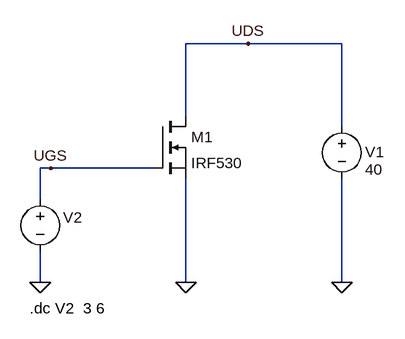
[diagram p0: schematic ID_vs_UGS.asc]
ID_vs_UGS.asc, the LTspice schematic file:
Version 4
SHEET 1 1292 680
WIRE -624 -240 -720 -240
WIRE -480 -240 -624 -240
WIRE -720 -128 -720 -240
WIRE -480 -112 -480 -240
WIRE -928 -48 -944 -48
WIRE -768 -48 -928 -48
WIRE -944 0 -944 -48
WIRE -944 128 -944 80
WIRE -720 128 -720 -32
WIRE -480 128 -480 -32
FLAG -480 128 0
FLAG -944 128 0
FLAG -720 128 0
FLAG -624 -240 UDS
FLAG -928 -48 UGS
SYMBOL voltage -480 -128 R0
WINDOW 123 0 0 Left 2
WINDOW 39 37 60 Left 2
WINDOW 0 36 55 Left 2
WINDOW 3 36 82 Left 2
SYMATTR InstName V1
SYMATTR Value 40
SYMBOL voltage -944 -16 R0
WINDOW 123 0 0 Left 2
WINDOW 39 40 53 Left 2
WINDOW 3 -97 181 Left 2
WINDOW 0 35 44 Left 2
SYMATTR Value ""
SYMATTR InstName V2
SYMBOL nmos -768 -128 R0
SYMATTR InstName M1
SYMATTR Value IRF530
TEXT -960 168 Left 2 !.dc V2  3 6

The netlist it stands for:
* ID_vs_UGS.asc
V1 UDS 0 40
V2 UGS 0
M1 UDS UGS 0 0 IRF530
.model NMOS NMOS
.model PMOS PMOS
.lib standard.mos
.dc V2  3 6
.backanno
.end